# Altium project Adapter.PrjPcb
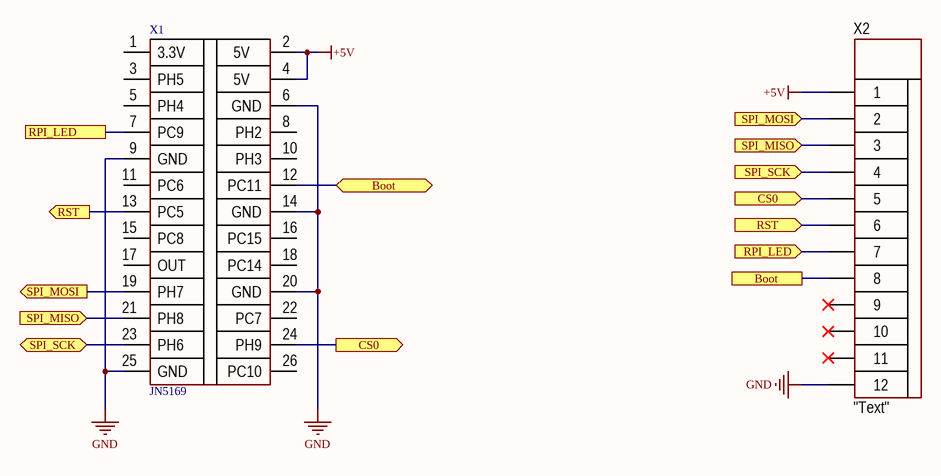
[diagram p0: Adapter.SchDoc]
1 sheet, 2 parts. Net scope: flat (ports and power ports of the same name join across sheets).
Board file: Adapter.PcbDoc

## Sheet Adapter.SchDoc
size A3

### Parts
X1  JN5169  [MOD: Orange pi zero 2 (26pin only) mirror cut]
X2  CommentText: "Text"  [CON: 0526101233]

### Ports
Boot, Boot (bidir), CS0 (in), CS0 (out), RPI_LED, RPI_LED (in), RST (in), RST (out), SPI_MISO (in), SPI_MOSI (in), SPI_MOSI (out), SPI_SCK (bidir), SPI_SCK (in)

### Nets
+5V: X1.2(5V) X1.4(5V) X2.1
GND: X1.6(GND) X1.9(GND) X1.14(GND) X1.20(GND) X1.25(GND) X2.12
Boot: X1.12(PC11) X2.8 ; port Boot
CS0: X1.24(PH9) X2.5 ; port CS0
RPI_LED: X1.7(PC9) X2.7 ; port RPI_LED
RST: X1.13(PC5) X2.6 ; port RST
SPI_MISO: X1.21(PH8) X2.3 ; port SPI_MISO
SPI_MOSI: X1.19(PH7) X2.2 ; port SPI_MOSI
SPI_SCK: X1.23(PH6) X2.4 ; port SPI_SCK

Not connected (* = marked no-connect by the designer): X1 1(3.3V) 3(PH5) 5(PH4) 8(PH2) 10(PH3) 11(PC6) 15(PC8) 16(PC15) 17(OUT) 18(PC14) 22(PC7) 26(PC10); X2 9* 10* 11*

### Library data of the parts
X1 = OrangePi Zero 2(26pin only): TYPE: Module
X2 = CON: 12 Pin V1: Manufacturer: Connfly; PartNumber: PLS-20; VoltageMax: 500VAC; Pitch: 2.54mm; CurrentMax: 3A; Multichannel: 20pin; HelpURL: https://www.chipdip.ru/product/pls-20; ValueManufacturerPartNumber: =TypeConnector+', '+Multichannel+', '+Pitch+', '+VoltageMax+', '+CurrentMax; TYPE: Connector